# EAGLE design espruino_wifi (EAGLE 7.7.0)
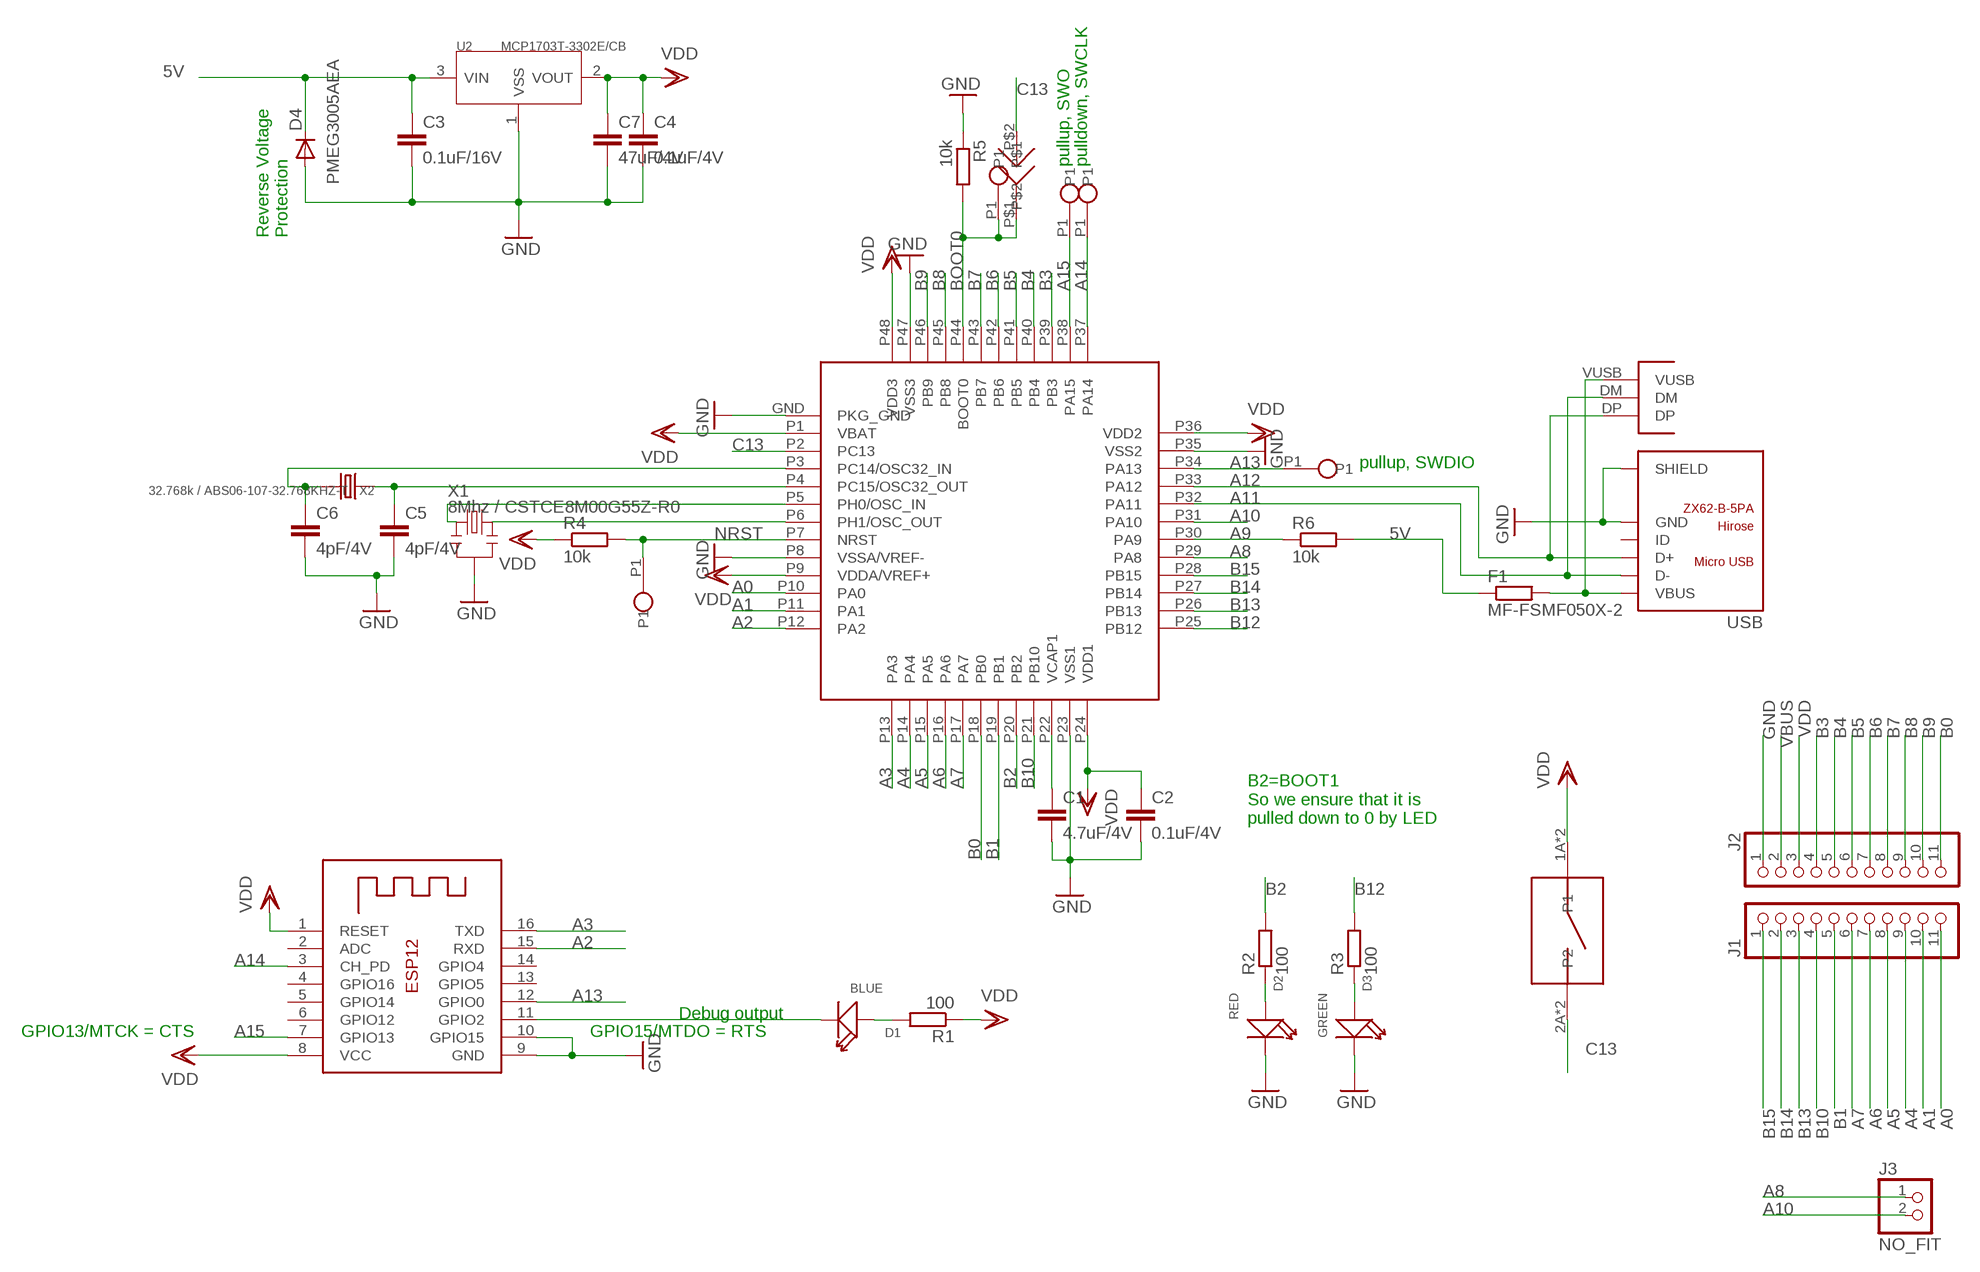
[diagram p0: schematic, sheet 1]

## Parts
B1  KMR421NG  [KMR421NG]
C1  4.7uF/4V  C0402  [C0402]
C2  0.1uF/4V  C0402  [C0402]
C3  0.1uF/16V  C0402  [C0402]
C4  0.1uF/4V  C0402  [C0402]
C5  4pF/4V  C0402  [C0402]
C6  4pF/4V  C0402  [C0402]
C7  47uF/4V  C-EUC1210  [C1210]
D1  BLUE  SMD-LED-CLEAR-BLUE(0402)  [LED-0402]
D2  RED  SMD-LED-CLEAR-BLUE(0402)  [LED-0402]
D3  GREEN  SMD-LED-CLEAR-BLUE(0402)  [LED-0402]
D4  PMEG3005AEA  DIODE-SOD323-W  [SOD323-W]
F1  MF-FSMF050X-2  R-EU_R0603  [R0603]
J1  PINHD-1X11_2.54-S  [1X11-S]
J2  PINHD-1X11_2.54-S  [1X11-S]
J3  NO_FIT  PINHD-1X02_2.54-S  [1X02-S]
J4  NO_FIT  SOLDERJUMPER  [SOLDERJUMPER]
PBOOT0  NO_FIT  SINGLE  [SINGLE]
PNRST  NO_FIT  SINGLE  [SINGLE]
PSWCLK  NO_FIT  SINGLE  [SINGLE]
PSWDIO  NO_FIT  SINGLE  [SINGLE]
PSWO  NO_FIT  SINGLE  [SINGLE]
PUSB  NO_FIT  USB  [USB]
R1  100  R0402  [R0402]
R2  100  R0402  [R0402]
R3  100  R0402  [R0402]
R4  10k  R0402  [R0402]
R5  10k  R0402  [R0402]
R6  10k  R0402  [R0402]
U1  STM32F411CEU6  STM32F401RCH  [UFQFPN48]
U2  MCP1703T-3302E/CB  XC6206  [SOT23]
U3  ESP-12  [ESP-12]
USB  ZX62-B-5PA  MICRO-USB-SMD(ZX62-B-5PA)  [MICRO-USB5+6P-SMD-0.65-AB]
X1  8Mhz / CSTCE8M00G55Z-R0  CRYSTAL-RESONATOR'SMD'  [3P-SMD-3.6X1.3]
X2  32.768k / ABS06-107-32.768KHZ-T  CRYSTAL'NX2012SA'  [2P-SMD-2.05X1.2]

## Nets
5V: C3.1 D4.C F1.1 R6.2 U2.3(VIN)
A0: J1.11 U1.P10(PA0)
A1: J1.10 U1.P11(PA1)
A2: U1.P12(PA2) U3.15(RXD)
A3: U1.P13(PA3) U3.16(TXD)
A4: J1.9 U1.P14(PA4)
A5: J1.8 U1.P15(PA5)
A6: J1.7 U1.P16(PA6)
A7: J1.6 U1.P17(PA7)
A8: J3.1 U1.P29(PA8)
A9: R6.1 U1.P30(PA9)
A10: J3.2 U1.P31(PA10)
A11: PUSB.DM U1.P32(PA11) USB.2(D-)
A12: PUSB.DP U1.P33(PA12) USB.3(D+)
A13: PSWDIO.P1 U1.P34(PA13) U3.12(GPIO0)
A14: PSWCLK.P1 U1.P37(PA14) U3.3(CH_PD)
A15: PSWO.P1 U1.P38(PA15) U3.7(GPIO13)
B0: J2.11 U1.P18(PB0)
B1: J1.5 U1.P19(PB1)
B2: R2.2 U1.P20(PB2)
B3: J2.4 U1.P39(PB3)
B4: J2.5 U1.P40(PB4)
B5: J2.6 U1.P41(PB5)
B6: J2.7 U1.P42(PB6)
B7: J2.8 U1.P43(PB7)
B8: J2.9 U1.P45(PB8)
B9: J2.10 U1.P46(PB9)
B10: J1.4 U1.P21(PB10)
B12: R3.2 U1.P25(PB12)
B13: J1.3 U1.P26(PB13)
B14: J1.2 U1.P27(PB14)
B15: J1.1 U1.P28(PB15)
BOOT0: J4.P$1 PBOOT0.P1 R5.2 U1.P44(BOOT0)
C13: B1.2A(P2) B1.2B(P2) J4.P$2 U1.P2(PC13)
GND: C1.3 C2.3 C3.3 C4.3 C5.3 C6.3 C7.2 D2.- D3.- D4.A J2.1 R5.1 U1.GND(PKG_GND) U1.P8(VSSA/VREF-) U1.P23(VSS1) U1.P35(VSS2) U1.P47(VSS3) U2.1(VSS) U3.9(GND) U3.10(GPIO15) USB.5(GND) USB.P1(SHIELD) USB.P2(SHIELD) USB.P3(SHIELD) USB.P4(SHIELD) USB.P5(SHIELD) USB.P6(SHIELD) X1.2
N$1: C5.1 U1.P4(PC15/OSC32_OUT) X2.1
N$2: C6.1 U1.P3(PC14/OSC32_IN) X2.2
N$3: U1.P5(PH0/OSC_IN) X1.1
N$4: U1.P6(PH1/OSC_OUT) X1.3
N$5: D2.+ R2.1
N$7: D3.+ R3.1
N$8: D1.+ R1.2
N$10: D1.- U3.11(GPIO2)
N$40: C1.1 U1.P22(VCAP1)
NRST: PNRST.P1 R4.2 U1.P7(NRST)
VBUS: F1.2 J2.2 PUSB.VUSB USB.1(VBUS)
VDD: B1.1A(P1) B1.1B(P1) C2.1 C4.1 C7.1 J2.3 R1.1 R4.1 U1.P1(VBAT) U1.P9(VDDA/VREF+) U1.P24(VDD1) U1.P36(VDD2) U1.P48(VDD3) U2.2(VOUT) U3.1(RESET) U3.8(VCC)
Unconnected: U3.2(ADC) U3.4(GPIO16) U3.5(GPIO14) U3.6(GPIO12) U3.13(GPIO5) U3.14(GPIO4) USB.4(ID)

## Notes on the sheet
- pullup, SWO | pulldown, SWCLK
- Reverse Voltage
  Protection
- pullup, SWDIO
- B2=BOOT1
  So we ensure that it is
  pulled down to 0 by LED
- Debug output
- GPIO13/MTCK = CTS | GPIO15/MTDO = RTS

## Library data of the parts
B1 = KMR421NG:KMR421NG
C1-C6 = Discrete:C0402
C7 = rcl:C-EU: CAPACITOR, European symbol
D1-D3 = OPL-Diode:SMD-LED-CLEAR-BLUE(0402): 304090075; MPN: BL-HB337A-AV-TRB; VALUE: BLUE-0402
D4 = diode:DIODE-: DIODE
F1 = rcl:R-EU_: RESISTOR, European symbol
J1 J2 = pinhead-2:PINHD-1X11: PIN HEADER
J3 = pinhead-2:PINHD-1X02: PIN HEADER
J4 = solder_jumper:SOLDERJUMPER
PBOOT0 PNRST PSWCLK PSWDIO PSWO = testpoint:SINGLE
PUSB = testpoint:USB
R1-R6 = Discrete:R0402
U1 = ufqfpn48:STM32F401RCH
U2 = xc6206:XC6206
U3 = adafruit:ESP-12
USB = Seeed-OPL-Connector:MICRO-USB-SMD(ZX62-B-5PA): 320010005; MPN: ZX62-B-5PA
X1 = Discrete:CRYSTAL-RESONATOR: Resonator Small SMD resonator. This is the itty bitty 10/20MHz resonators with built in caps. CSTCE10M0G55 and CSTCE20M0V53. Footprint has been reviewed closely but hasn't been tested yet.
X2 = Discrete:CRYSTAL*: CRYSTAL

## Board
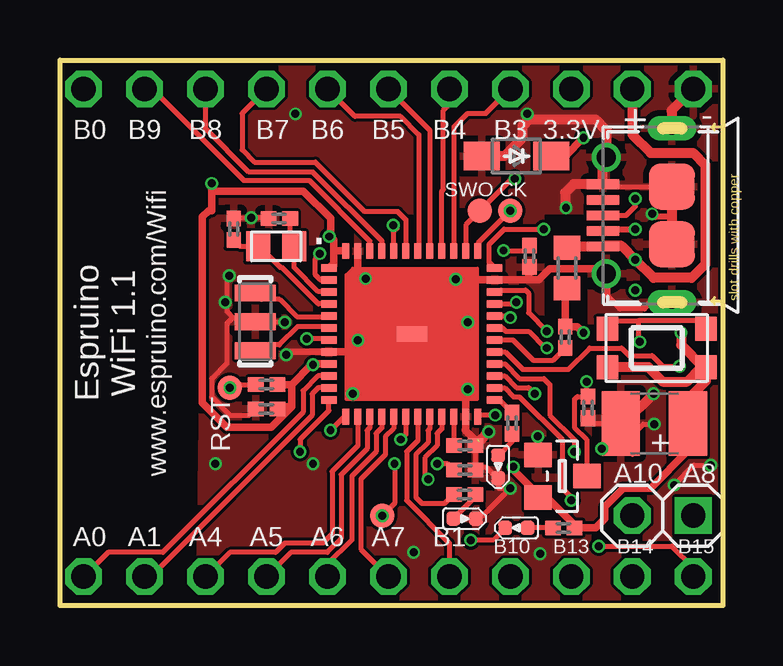
[diagram p1: board, top side]
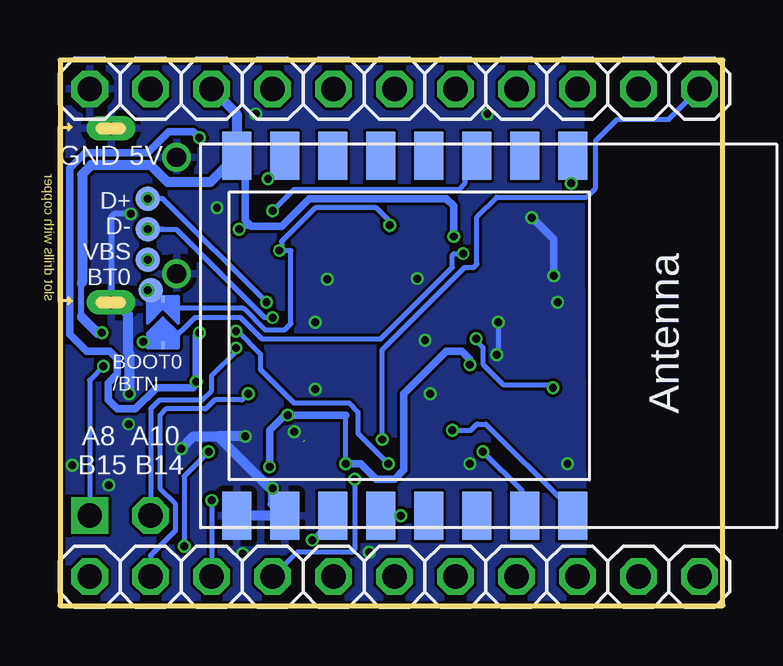
[diagram p2: board, bottom side, seen from below]

Size 27.62 x 22.73 mm. Coordinates in mm from the lower left corner, seen from the top.
Outline: 27.62,0 0,0 0,22.73 27.62,22.73 27.62,0
Copper layers (1*16): Top 0.035559375mm / dielectric 0.17018125mm / Bottom 0.035559375mm
Design rules "OSHPark-4layer *": minimum track width 5mil, minimum drill 10mil, track to track 5mil, track to pad 5mil, pad to pad 5mil, via to via 5mil, smd to smd 0mil, copper to edge 4mil, drill to drill 6mil, minimum pad ring 4mil, minimum via ring 4mil, stop-mask expansion 4mil, vias tented up to drill 15mil, thermal gap 10mil

### Footprints (pad centres in the part's own frame; a part is rotated, then mirrored left to right if it is on the bottom)
KMR421NG = smd 0.9 x 1: 1A -2.05,0.8; 1B 2.05,0.8; 2A -2.05,-0.8; 2B 2.05,-0.8
C0402 = smd 0.65 x 0.6: 1 -0.45,0; 3 0.45,0
C1210 = smd 1.6 x 2.7: 1 -1.4,0; 2 1.4,0
LED-0402 = smd 0.58 x 0.58: + -0.468,0; - 0.468,0
SOD323-W = smd 1.5 x 1.2: A 1.45,0; C -1.45,0
R0603 = smd 1 x 1.1: 1 -0.85,0; 2 0.85,0
1X11-S = drill 1.016 octagon: 1 -12.7,0; 2 -10.16,0; 3 -7.62,0; 4 -5.08,0; 5 -2.54,0; 6 0,0; 7 2.54,0; 8 5.08,0; 9 7.62,0; 10 10.16,0; 11 12.7,0
1X02-S = drill 1.016 square: 1 -1.27,0 | drill 1.016 octagon: 2 1.27,0
SOLDERJUMPER = smd 0.305 x 0.152: P$1 0.762,0; P$2 -1.143,0
SINGLE = smd 1.016 x 1.016: P1 0,0
USB = smd 1.016 x 1.016: DM -0.635,0; DP 0.635,0; VUSB -1.905,0
R0402 = smd 0.65 x 0.6: 1 -0.45,0; 2 0.45,0
UFQFPN48 = smd 1.27 x 0.635: GND 0,0 | smd 0.65 x 0.3: P1 -3.45,2.75; P2 -3.45,2.25; P3 -3.45,1.75; P4 -3.45,1.25; P5 -3.45,0.75; P6 -3.45,0.25; P7 -3.45,-0.25; P8 -3.45,-0.75; P9 -3.45,-1.25; P10 -3.45,-1.75; P11 -3.45,-2.25; P12 -3.45,-2.75; P25 3.45,-2.75; P26 3.45,-2.25; P27 3.45,-1.75; P28 3.45,-1.25; P29 3.45,-0.75; P30 3.45,-0.25; P31 3.45,0.25; P32 3.45,0.75; P33 3.45,1.25; P34 3.45,1.75; P35 3.45,2.25; P36 3.45,2.75 | smd 0.3 x 0.65: P13 -2.75,-3.45; P14 -2.25,-3.45; P15 -1.75,-3.45; P16 -1.25,-3.45; P17 -0.75,-3.45; P18 -0.25,-3.45; P19 0.25,-3.45; P20 0.75,-3.45; P21 1.25,-3.45; P22 1.75,-3.45; P23 2.25,-3.45; P24 2.75,-3.45; P37 2.75,3.45; P38 2.25,3.45; P39 1.75,3.45; P40 1.25,3.45; P41 0.75,3.45; P42 0.25,3.45; P43 -0.25,3.45; P44 -0.75,3.45; P45 -1.25,3.45; P46 -1.75,3.45; P47 -2.25,3.45; P48 -2.75,3.45
SOT23 = smd 1.016 x 1.143: 1 -0.889,-1.016; 2 0.889,-1.016; 3 0,1.016
ESP-12 = smd 2 x 1.2: 1 -7.5,4.5; 2 -7.5,2.5; 3 -7.5,0.5; 4 -7.5,-1.5; 5 -7.5,-3.5; 6 -7.5,-5.5; 7 -7.5,-7.5; 8 -7.5,-9.5; 9 7.5,-9.5; 10 7.5,-7.5; 11 7.5,-5.5; 12 7.5,-3.5; 13 7.5,-1.5; 14 7.5,0.5; 15 7.5,2.5; 16 7.5,4.5
MICRO-USB5+6P-SMD-0.65-AB = smd 0.4 x 1.35: 1 -1.3,2.875; 2 -0.65,2.875; 3 0,2.875; 4 0.65,2.875; 5 1.3,2.875 | smd 1.9 x 1.9: P1 -1.2,0; P2 1.2,0 | drill 0.508 pad 1.016 long: P3 -3.625,0; P4 3.625,0 | drill 0.8: P5 -2.425,2.73; P6 2.425,2.73
3P-SMD-3.6X1.3 = smd 0.7 x 1.7: 1 -1.2,0; 2 0,0; 3 1.2,0
2P-SMD-2.05X1.2 = smd 1 x 1.25: 1 -0.75,0; 2 0.75,0

### Placement (x,y rotation side)
B1  24.86,10.73 180 top
C1  16.86,6.67 0 top
C2  16.86,5.65 0 top
C3  22,8.26 270 top
C4  8.6,8.19 180 top
C5  7.24,15.68 90 top
C6  9.14,16.13 180 top
C7  24.77,7.59 180 top
D1  19.02,3.24 180 top
D2  16.86,3.62 0 top
D3  18.26,5.78 270 top
D4  19.02,18.73 180 top
F1  21.13,14.07 90 top
J1  13.68,1.21 0 bottom
J2  13.68,21.53 0 bottom
J3  25.11,3.75 180 top
J4  23.34,12 90 bottom
PBOOT0  23.84,13.14 0 bottom
PNRST  7.08,9.08 0 top
PSWCLK  18.76,16.45 0 top
PSWDIO  13.43,3.75 0 top
PSWO  17.49,16.45 0 top
PUSB  23.97,16.32 90 bottom
R1  20.99,3.24 180 top
R2  16.86,4.64 180 top
R3  18.83,7.6 90 top
R4  8.6,9.21 180 top
R5  19.56,14.56 90 top
R6  21.05,11.18 90 top
U1  14.66,11.32 0 top
U2  20.94,5.39 270 top
U3  10.76,11.24 270 bottom
USB  25.5,16.26 90 top
X1  8.14,11.82 270 top
X2  9,14.97 0 top

### Tracks (layer width: path | path; a pad name or v marks a point on that pad's centre or on a via)
5V  (via drill 0.33)
  Top 0.203: 22.21,5.65 U2.3 21.94,5.41 21.94,6.92 21.43,7.43 21.43,8.58 21.56,8.7 C3.1 21.94,8.77 v21.94,9.33
  Top 0.305: F1.1 arc90 21.05,13.14 R6.2 21.56,11.62 v21.81,11.37 | v21.81,19.49 21.05,18.73
  Top 0.406: D4.C 21.05,18.73
  Bottom 0.203: 22.07,9.08 21.94,9.21 v21.94,9.33
  Bottom 0.305: 22.07,9.08 23.59,9.08 24.48,8.19 25.24,8.19 25.62,8.57 25.62,9.27 25.24,9.65 25.24,10.29 25.56,10.6 26.51,10.6 27.21,11.3 27.21,18.22 26.57,18.86 23.97,18.86 23.08,19.75 22.07,19.75 v21.81,19.49 | 21.94,9.65 v21.94,9.33 21.94,11.24 v21.81,11.37
A0
  Top 0.203: U1.P10 10.74,9.57 10.13,8.95 10.13,8.06 4.29,2.22 2,2.22 J1.11
A1
  Top 0.203: U1.P11 10.75,9.07 10.51,8.83 10.51,7.94 3.78,1.21 J1.10
A2  (via drill 0.33)
  Top 0.203: U1.P12 11.21,8.13 10,6.92 v10,6.41
  Bottom 0.203: U3.15 8.35,3.83 8.35,4.76 v10,6.41
A3  (via drill 0.33)
  Top 0.203: U1.P13 11.84,7.87 v11.27,7.3
  Bottom 0.203: v11.27,7.3 10.51,7.3 10.26,7.56 9.87,7.56 6.57,4.25 6.57,4.05 U3.16
A4
  Top 0.203: U1.P14 12.41,6.67 11.33,5.59 11.33,2.98 10.95,2.6 9.37,2.6 8.99,2.22 7.08,2.22 J1.9
A5
  Top 0.203: U1.P15 12.91,7.42 12.8,7.3 12.8,6.54 11.72,5.46 11.72,2.79 11.14,2.22 9.62,2.22 J1.8
A6
  Top 0.203: U1.P16 13.41,7.41 13.18,7.18 13.18,6.41 12.16,5.4 12.16,2.73 11.14,1.71 J1.7
A7
  Top 0.203: U1.P17 13.91,7.4 13.56,7.05 13.56,6.29 12.54,5.27 12.54,2.35 J1.6
A8  (via drill 0.33)
  Top 0.203: U1.P29 18.55,10.57 19.27,9.84 21.18,9.84 22.07,10.73 23.4,10.73 23.72,10.41 24.67,10.41 25.11,9.97 v25.81,9.97
  Bottom 0.203: v25.81,9.97 26.38,9.4 J3.1
A9
  Top 0.203: U1.P30 18.87,11.07 19.72,10.22 20.55,10.22 R6.1
A10  (via drill 0.33)
  Top 0.203: U1.P31 18.43,11.57 18.57,11.43 19.53,11.43 20.23,10.73 v20.29,10.73
  Bottom 0.203: J3.2 23.84,8.19 23.46,8.57 21.69,8.57 21.3,8.95 21.3,9.59 20.29,10.6 v20.29,10.73
A11  (via drill 0.33)
  Top 0.203: U1.P32 18.7,12.07 v18.76,12 | 22.71,15.68 PUSB.DM 23.96,15.67 22.83,15.67 22.74,15.58 22.68,15.58 22.65,15.61 USB.2
  Bottom 0.203: v18.76,12 19.1,12 22.76,15.67 23.32,15.67 | 23.32,15.67 24.21,15.67 | 23.32,15.67 23.34,15.68 PUSB.DM
  other vias: 23.97,15.68
A12  (via drill 0.33)
  Top 0.203: U1.P33 18.95,12.57 v19.02,12.64 | USB.3 23.59,16.26 23.97,16.64 PUSB.DP
  Bottom 0.203: v19.02,12.64 23.34,16.95 PUSB.DP
  other vias: 23.97,16.95
A13  (via drill 0.33)
  Top 0.203: v20.29,11.43 19.53,12.19 19.53,13.02 19.4,13.14 18.38,13.14 18.31,13.07 U1.P34 | v13.94,5.91 13.94,4.25 PSWDIO.P1
  Bottom 0.203: v20.29,11.43 20.23,11.43 19.27,10.48 19.27,9.84 17.88,8.45 15.59,8.45 15.21,8.06 15.21,7.18 v13.94,5.91 | PSWDIO.P1 U3.12
  other vias: 13.43,3.75
A14  (via drill 0.33)
  Top 0.203: 17.39,14.79 U1.P37 17.41,15.09 PSWCLK.P1
  Bottom 0.203: U3.3 10.76,18.24 10.76,17.59 11.02,17.34 17.88,17.34 PSWCLK.P1
  other vias: 18.76,16.45
A15  (via drill 0.33)
  Top 0.203: U1.P38 16.91,15.86 PSWO.P1 18.83,17.78 v18.96,17.78
  Bottom 0.203: U3.7 18.26,18.47 v18.96,17.78
B0  (via drill 0.33)
  Top 0.203: U1.P18 14.41,7.14 v14.19,6.92
  Bottom 0.203: v14.19,6.92 14.19,10.67 10.76,14.1 10.38,14.1 10.26,14.22 10.26,16.19 9.43,17.02 5.68,17.02 5.3,17.4 5.3,19.37 4.41,20.26 2.25,20.26 J2.11
B1
  Top 0.203: U1.P19 14.91,6.88 14.45,6.41 14.45,4.38 16.22,2.6 J1.5
B2
  Top 0.203: U1.P20 15.41,7.38 15.34,7.3 15.34,6.79 14.83,6.29 14.83,4.51 15.08,4.25 16.03,4.25 R2.2
B3
  Top 0.203: U1.P39 16.41,19.93 16.99,20.51 17.75,20.51 J2.4
B4
  Top 0.203: U1.P40 15.91,17.27 15.97,17.34 15.97,20.64 16.22,20.89 J2.5
B5
  Top 0.203: J2.6 15.41,19.8 U1.P41
B6
  Top 0.203: U1.P42 14.95,14.82 14.95,19.62 14.19,20.38 12.29,20.38 J2.7
B7
  Top 0.203: J2.8 7.59,20.51 7.59,18.99 8.1,18.48 10.64,18.48 12.7,16.41 14.08,16.41 14.41,16.08 U1.P43
B8
  Top 0.203: J2.9 6.06,19.88 7.87,18.07 10.54,18.07 13.41,15.2 U1.P45
B9
  Top 0.203: U1.P46 12.91,15.19 10.38,17.72 7.65,17.72 3.84,21.53 J2.10
B10  (via drill 0.33)
  Top 0.203: U1.P21 15.91,7.37 15.72,7.18 15.72,6.67 15.21,6.16 15.21,5.4 v15.34,5.27
  Bottom 0.203: v15.34,5.27 15.34,2.35 15.46,2.22 17.75,2.22 J1.4
B12
  Top 0.203: U1.P25 18.31,8.57 R3.2
B13  (via drill 0.33)
  Top 0.203: U1.P26 18.52,9.07 18.89,8.7 19.15,8.7 20.92,6.92 20.92,4.89 21.3,4.51 v21.3,4.38
  Bottom 0.203: v21.3,4.38 J1.3
B14  (via drill 0.33)
  Top 0.203: U1.P27 18.53,9.57 19.02,9.08 19.53,9.08 v19.78,8.83
  Bottom 0.203: v19.78,8.83 20.03,8.57 21.18,8.57 21.56,8.19 23.21,8.19 23.46,7.94 23.46,4.89 22.83,4.25 22.83,3.11 23.84,2.1 J1.2
B15  (via drill 0.33)
  Top 0.203: U1.P28 18.54,10.07 19.15,9.46 20.16,9.46 20.42,9.21 20.42,7.94 21.43,6.92 v21.43,6.41 | v22.45,2.48 25.5,2.48 26.38,1.59 J1.1
  Bottom 0.203: v21.43,6.41 22.45,5.4 v22.45,2.48
BOOT0  (via drill 0.33)
  Top 0.203: U1.P44 13.91,15.58 13.9,15.58 13.9,15.83 v13.89,15.84 | v13.89,15.84 14.03,15.84 14.03,15.72 | v13.89,15.84 13.89,15.72 13.9,15.71 | v18.48,14.8 19.35,14.8 R5.2
  Bottom 0.203: 13.9,15.65 13.9,15.83 v13.89,15.84 13.9,15.84 13.9,16.03 14.45,16.57 16.99,16.57 18.38,15.18 18.38,14.89 v18.48,14.8 18,14.8 18,11.75 18.26,11.49 19.08,11.49 19.97,12.38 22.83,12.38 23.21,12.76 J4.P$1 23.72,13.14 PBOOT0.P1 | PBOOT0.P1 23.59,12.89 | v23.97,13.14 PBOOT0.P1
C13  (via drill 0.33)
  Top 0.203: U1.P2 10.85,13.57 10.64,13.78 10.64,14.45 10.83,14.64 v10.83,14.67 | B1.2B 22.81,11.87 24.1,11.87 | 26.91,11.38 B1.2A 26.57,11.87 24.1,11.87 | 24.1,11.87 24.1,10.99 v24.16,10.99
  Bottom 0.203: 10.83,14.64 v10.83,14.67 11.21,14.67 11.27,14.6 11.27,14.1 14.26,11.11 19.21,11.11 20.1,12 22,12 23.15,10.86 J4.P$2 24.03,10.86 v24.16,10.99
GND  (via drill 0.33)  (1 unrouted)
  Top 0.203: 12.29,10.57 13.91,10.57 13.94,10.6 U1.GND | 9.38,11.82 X1.2 7.95,12 7.21,12 | 16.22,12.89 16.46,13.12 16.46,13.57 16.46,13.6 v16.48,13.6 16.51,13.57 | 12.29,10.57 12.16,10.57 | 12.41,13.57 12.35,13.63 v12.73,13.63 12.41,13.31 v12.41,11.06 12.41,10.7 12.29,10.57 | v7.05,13.75 6.95,13.65 6.95,12.26 7.21,12 | 9.48,11.82 9.38,11.82 | 9.38,11.82 v9.37,11.81 | 9.56,10.57 v9.43,10.45 | 12.45,10.41 12.41,10.44 | v16.99,11.81 16.99,11.87 16.1,12.76 | 17.89,7.21 v17.86,7.24 | 17.46,6.84 17.33,6.71 | 7.21,12 6.95,11.75 6.95,10.1 6.32,9.46 6.32,8.7 7.08,7.94 7.9,7.94 C4.3 | C1.3 C2.3 17.44,5.78 17.75,5.78 18.22,5.31 D3.- 18.26,4.89 v18.76,4.89 17.62,3.75 17.49,3.75 17.37,3.62 D2.- | 23.84,6.29 23.84,7.11 | 23.84,7.11 C7.2 | C7.2 23.37,7.33 v22.57,6.54 | C6.3 8.66,16.16 v7.97,16.16 7.27,16.16 C5.3 | C3.3 22.22,7.59 C7.2 | USB.5 22.72,17.46 USB.P2 | 23.84,7.11 24.3,7.56 v24.77,7.56 | v25.59,5.02 26.42,5.85 v27.11,5.85
  Top 0.254: USB.P3 24.6,12.63 24.35,12.38 23.34,12.38 22.83,12.89 22.83,13.77 USB.P5 | USB.P1 25.5,16.07 25.37,16.19 24.8,16.19 v24.67,16.32
  Top 0.279: U1.P8 9.56,10.57
  Top 0.305: U1.P47 12.41,13.57 | 12.41,10.44 12.29,10.57 | 17.42,6.91 17.28,6.91 16.89,7.3 16.89,7.33 16.91,7.35 U1.P23 16.91,8.94 v16.99,9.02 | U1.P8 12.16,10.57 | 14.68,9.87 13.94,10.6 | 19.53,13.57 U1.P35 16.51,13.57 | 19.53,13.57 19.95,13.57 20.42,14.03 22.56,14.03 USB.P5 | R5.1 19.53,14.11 19.53,13.57 | U2.1 19.91,6.29 v19.91,7.05
  Top 0.406: 16.22,12.89 16.1,12.76 U1.GND | 16.46,13.88 16.46,13.57 | v17.86,7.24 17.46,6.84 | J2.1 25.47,20.62 25.5,20.62 USB.P4 | v24.73,8.83 23.5,7.59 C7.2 | USB.P2 USB.P1 | v21.08,16.58 21.05,16.61 21.05,17.21 21.4,17.56 USB.5 22.62,18.54 USB.P6 22.77,19.81 22.32,20.26 19.53,20.26 | 17.24,18.73 18.51,18.73 19.27,19.49 19.27,20 19.53,20.26 | 19.53,20.26 19.46,20.32 v19.46,20.49
  Bottom 0.203: v9.37,11.81 9.37,10.54 9.43,10.48 v9.43,10.45 | 16.43,13.65 v16.48,13.6 | 18.76,4.24 U3.10
  Bottom 0.254: v24.67,16.32 25.37,16.32 25.5,16.19 USB.P3
  Bottom 0.305: v7.05,13.75 7.05,15.27 7.81,16.03 | 18.89,4.89 v18.76,4.89
  Bottom 0.406: v18.76,4.89 18.76,4.24 | U3.10 U3.9 | v22.57,6.54 22.07,7.05 21.05,7.05 | 21.05,7.05 18.89,4.89 | v19.91,7.05 21.05,7.05 | v24.73,8.83 24.73,10.48 24.8,10.54 24.8,12.13 25.3,12.63 USB.P3
  other vias: 12.19,8.83 6.89,12.64 10.54,5.91 6.48,5.91 9.81,20.49 14.73,2.23 20,2.17
  pour Bottom: 5.94,22.67 27.65,22.67 27.53,0.06 5.81,-0.06
  pour Top: 6.19,23.94 22.07,23.94 22.07,16.45 20.03,16.45 20.03,11.62 22.13,11.62 22.13,23.94 27.91,23.94 27.53,0.06 5.81,-0.06
N$1
  Top 0.203: U1.P4 10.76,12.57 9.24,14.1 9.18,14.1 8.73,14.54 8.16,14.54 8.13,14.57 8.25,14.7 X2.1 7.51,14.97 C5.1
N$2
  Top 0.203: U1.P3 11.2,13.08 10.76,13.08 9.75,14.09 X2.2 9.63,14.97 9.59,15 C6.1
N$3
  Top 0.203: 11.21,12.03 U1.P5 11.18,12.04 9.87,12.04 9.15,12.76 8.39,12.76 X1.1
N$4
  Top 0.203: 11.23,11.62 11.16,11.62 | 11.16,11.62 9.91,11.62 9.14,10.86 8.37,10.86 X1.3 | U1.P6 11.16,11.62
N$5
  Top 0.203: R2.1 17.31,4.54 D2.+
N$7
  Top 0.203: R3.1 18.83,6.82 D3.+
N$8
  Top 0.203: R1.2 D1.+
N$10  (via drill 0.33)
  Top 0.203: D1.- 18.04,2.73 v17.11,2.73
  Bottom 0.203: 16.61,3.74 U3.11 16.26,3.58 v17.11,2.73
N$40
  Top 0.203: U1.P22 C1.1 | C1.1 16.41,6.47 16.51,6.47 16.51,6.5 | 16.43,6.67 C1.1
NRST  (via drill 0.33)
  Top 0.203: U1.P7 11.21,11.11 v10.29,11.11 | R4.2 7.53,9.21 7.33,9.02 7.27,9.08 PNRST.P1
  Bottom 0.203: v10.29,11.11 10.29,11.05 10,10.76 10,10.06 9.14,9.21 7.21,9.21 PNRST.P1
  other vias: 7.08,9.08
VBUS  (via drill 0.33)
  Top 0.305: 22.65,14.99 USB.1
  Top 0.406: USB.1 21.17,14.96 F1.2 | 22.65,14.99 23.4,14.99 PUSB.VUSB 24.73,13.65 26.32,13.65 26.89,14.22 26.89,18.35 26.38,18.86 24.61,18.86 23.84,19.62 J2.2
  Bottom 0.406: 23.84,14.41 PUSB.VUSB
  other vias: 23.97,14.41
VDD  (via drill 0.33)
  Top 0.203: U1.P1 11.21,14.1 | v18.13,7.94 17.48,7.94 U1.P24 | U1.P36 17.88,14.3 17.88,15.05 18.51,15.68 v20.16,15.68 | C2.1 16.16,5.91 v15.72,5.91 | 19.91,4.19 19.92,4.2
  Top 0.305: U1.P9 10.48,10.07 10.48,10.06 10.51,10.03 | U1.P48 11.88,14.8 11.4,14.8 | 11.4,14.8 11.4,15.24 11.36,15.24 v11.22,15.38 | 11.4,14.8 11.4,14.16 11.3,14.16 U1.P1 | 10.45,9.97 10.51,10.03 | 9.65,8.28 9.65,9.17 9.62,9.21 R4.1 9.65,9.21 10.48,10.03 10.51,10.03 | C7.1 26.17,6.45 24.61,4.89 23.46,4.89 22.7,4.13 22.7,3.62 22.32,3.24 21.56,3.24 | 19.91,4.49 U2.2 19.92,4.2 | 19.91,4.19 19.91,4.64 18.89,5.65 v18.89,5.78 | 6.32,17.27 10.13,17.27 11.27,16.13 11.27,15.43 v11.22,15.38 | 6.32,17.27 6.32,16.45 6.19,16.45 5.94,16.19 5.94,8.45 6.95,7.43 8.8,7.43 9.65,8.28 | 6.32,17.27 v6.32,17.59 | 10.51,10.03 v10.54,10.03 | 26.8,9.93 B1.1A | v11.22,15.38 11.21,15.37 | 9.65,8.28 9.14,8.28 C4.1 | 21.56,3.24 R1.1 | 21.56,3.24 20.29,4.51
  Top 0.406: C7.1 26.38,7.81 26.38,8.83 26.91,9.35 B1.1A 26.73,9.93 26.13,9.33 25.11,9.33 24.52,9.93 B1.1B | v25.88,11.37 25.88,10.86 26.8,9.93
  Bottom 0.203: v15.72,5.91 15.72,7.94 | 17.88,7.94 v18.13,7.94 | v20.16,15.68 20.03,15.81 19.27,15.81
  Bottom 0.254: 26.77,13.4 26.77,12.07
  Bottom 0.305: 15.72,7.94 17.88,7.94 | v11.22,15.38 11.22,16.65 11.53,16.95 17.24,16.95 18.38,15.81 19.27,15.81 19.65,15.81 19.91,16.07 19.91,18.38 U3.8 | 10.48,9.97 v10.54,10.03 10.54,10.26 10.89,10.6 11.53,10.6 13.3,8.83 13.3,5.65 13.68,5.27 14.45,5.27 15.08,5.91 v15.72,5.91 | v18.89,5.78 18.89,7.3 18.26,7.94 v18.13,7.94 | v6.32,17.59 6.26,17.64 U3.1 | 26.7,13.46 26.77,13.4 | 26.77,12.07 26.7,12
  Bottom 0.406: J2.3 20.26,20.49 U3.8 21.35,17.65 23.15,17.65 23.84,18.35 26.32,18.35 26.7,17.97 26.7,13.46 | 26.7,12 26.07,11.37 v25.88,11.37

### Text on the board
tNames: + | - | B0 | B9 | B8 | B7 | B6 | B5 | B4 | B3 | 3.3V | SWO CK | . | Espruino / WiFi 1.1 | www.espruino.com/Wifi | RST | A10 | + | A8 | A0 | A1 | A4 | A5 | A6 | A7 | B1 | B10 | B13 | B14 | B15
bNames: 5V | GND | D+ / D- / VBS / BT0 | BOOT0 / /BTN | A8 A10 / B15 B14
bNames2: C3 | C5 | FUSE | R3 | C6 | X2 | C4 | B1 | U2 | X1 | D1 | C2 | R2 | D3 | R1 | R6 | R4 | Q1 | R5 | D2 | C1